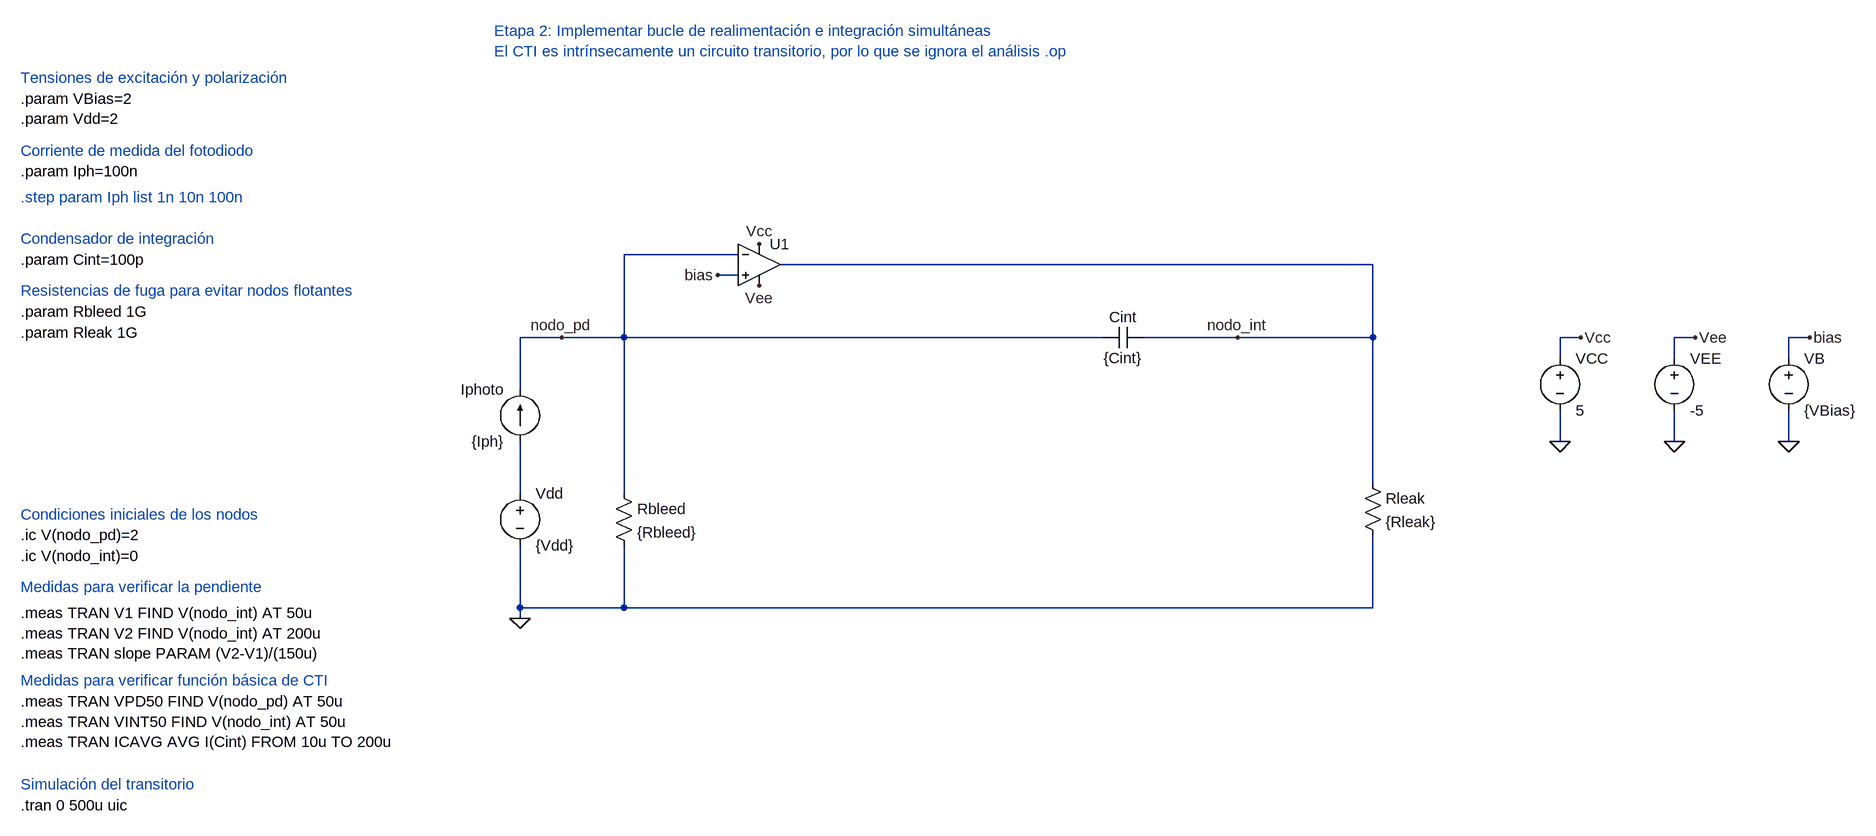
[diagram p0: schematic CTI_Etapa2.asc]
CTI_Etapa2.asc, the LTspice schematic file:
Version 4.1
SHEET 1 2360 1408
WIRE 416 384 240 384
WIRE 1392 400 480 400
WIRE 416 416 384 416
WIRE 144 512 80 512
WIRE 240 512 240 384
WIRE 240 512 144 512
WIRE 976 512 240 512
WIRE 1184 512 1040 512
WIRE 1392 512 1392 400
WIRE 1392 512 1184 512
WIRE 1712 512 1680 512
WIRE 1888 512 1856 512
WIRE 2064 512 2032 512
WIRE 1680 544 1680 512
WIRE 1856 544 1856 512
WIRE 2032 544 2032 512
WIRE 80 592 80 512
WIRE 1680 672 1680 624
WIRE 1856 672 1856 624
WIRE 2032 672 2032 624
WIRE 1392 736 1392 512
WIRE 80 752 80 672
WIRE 240 752 240 512
WIRE 80 928 80 832
WIRE 240 928 240 832
WIRE 240 928 80 928
WIRE 1392 928 1392 816
WIRE 1392 928 240 928
WIRE 80 944 80 928
FLAG 80 944 0
FLAG 144 512 nodo_pd
FLAG 1184 512 nodo_int
FLAG 2064 512 bias
FLAG 1680 672 0
FLAG 1856 672 0
FLAG 1712 512 Vcc
FLAG 1888 512 Vee
FLAG 448 368 Vcc
FLAG 448 432 Vee
FLAG 384 416 bias
FLAG 2032 672 0
SYMBOL voltage 2032 528 R0
SYMATTR InstName VB
SYMATTR Value {VBias}
SYMBOL current 80 672 R180
WINDOW 0 24 80 Left 2
WINDOW 3 24 0 Left 2
SYMATTR InstName Iphoto
SYMATTR Value {Iph}
SYMBOL cap 976 528 R270
WINDOW 0 32 32 VTop 2
WINDOW 3 0 32 VBottom 2
SYMATTR InstName Cint
SYMATTR Value {Cint}
SYMBOL res 224 736 R0
SYMATTR InstName Rbleed
SYMATTR Value {Rbleed}
SYMBOL res 1376 720 R0
SYMATTR InstName Rleak
SYMATTR Value {Rleak}
SYMBOL voltage 80 736 R0
SYMATTR InstName Vdd
SYMATTR Value {Vdd}
SYMBOL OpAmps\\UniversalOpAmp2 448 400 R0
SYMATTR InstName U1
SYMBOL voltage 1680 528 R0
SYMATTR InstName VCC
SYMATTR Value 5
SYMBOL voltage 1856 528 R0
SYMATTR InstName VEE
SYMATTR Value -5
TEXT 40 40 Left 2 ;Etapa 2: Implementar bucle de realimentación e integración simultáneas\nEl CTI es intrínsecamente un circuito transitorio, por lo que se ignora el análisis .op
TEXT -688 112 Left 2 ;Tensiones de excitación y polarización
TEXT -688 144 Left 2 !.param VBias=2\n.param Vdd=2
TEXT -688 224 Left 2 ;Corriente de medida del fotodiodo
TEXT -688 256 Left 2 !.param Iph=100n
TEXT -688 360 Left 2 ;Condensador de integración
TEXT -688 392 Left 2 !.param Cint=100p
TEXT -688 1232 Left 2 !.tran 0 500u uic
TEXT -688 1200 Left 2 ;Simulación del transitorio
TEXT -688 296 Left 2 ;.step param Iph list 1n 10n 100n
TEXT -688 896 Left 2 ;Medidas para verificar la pendiente
TEXT -688 936 Left 2 !.meas TRAN V1 FIND V(nodo_int) AT 50u\n.meas TRAN V2 FIND V(nodo_int) AT 200u\n.meas TRAN slope PARAM (V2-V1)/(150u)
TEXT -688 440 Left 2 ;Resistencias de fuga para evitar nodos flotantes
TEXT -688 472 Left 2 !.param Rbleed 1G
TEXT -688 504 Left 2 !.param Rleak 1G
TEXT -688 1040 Left 2 ;Medidas para verificar función básica de CTI
TEXT -688 1072 Left 2 !.meas TRAN VPD50 FIND V(nodo_pd) AT 50u\n.meas TRAN VINT50 FIND V(nodo_int) AT 50u\n.meas TRAN ICAVG AVG I(Cint) FROM 10u TO 200u
TEXT -688 784 Left 2 ;Condiciones iniciales de los nodos
TEXT -688 816 Left 2 !.ic V(nodo_pd)=2
TEXT -688 848 Left 2 !.ic V(nodo_int)=0

The netlist it stands for:
* CTI_Etapa2.asc
VB bias 0 {VBias}
Iphoto N001 nodo_pd {Iph}
Cint nodo_pd nodo_int {Cint}
Rbleed nodo_pd 0 {Rbleed}
Rleak nodo_int 0 {Rleak}
Vdd N001 0 {Vdd}
X§U1 bias nodo_pd Vcc Vee nodo_int level2 Avol=1Meg GBW=10Meg Slew=10Meg Ilimit=25m Rail=0 Vos=0 En=0 Enk=0 In=0 Ink=0 Rin=500Meg  ; pins In+ In- V+ V- OUT
VCC Vcc 0 5
VEE Vee 0 -5
* Etapa 2: Implementar bucle de realimentación e integración simultáneas
* El CTI es intrínsecamente un circuito transitorio, por lo que se ignora el análisis .op
* Tensiones de excitación y polarización
.param VBias=2
.param Vdd=2
* Corriente de medida del fotodiodo
.param Iph=100n
* Condensador de integración
.param Cint=100p
.tran 0 500u uic
* Simulación del transitorio
* .step param Iph list 1n 10n 100n
* Medidas para verificar la pendiente
.meas TRAN V1 FIND V(nodo_int) AT 50u
.meas TRAN V2 FIND V(nodo_int) AT 200u
.meas TRAN slope PARAM (V2-V1)/(150u)
* Resistencias de fuga para evitar nodos flotantes
.param Rbleed 1G
.param Rleak 1G
* Medidas para verificar función básica de CTI
.meas TRAN VPD50 FIND V(nodo_pd) AT 50u
.meas TRAN VINT50 FIND V(nodo_int) AT 50u
.meas TRAN ICAVG AVG I(Cint) FROM 10u TO 200u
* Condiciones iniciales de los nodos
.ic V(nodo_pd)=2
.ic V(nodo_int)=0
.lib UniversalOpAmp2.lib
.backanno
.end